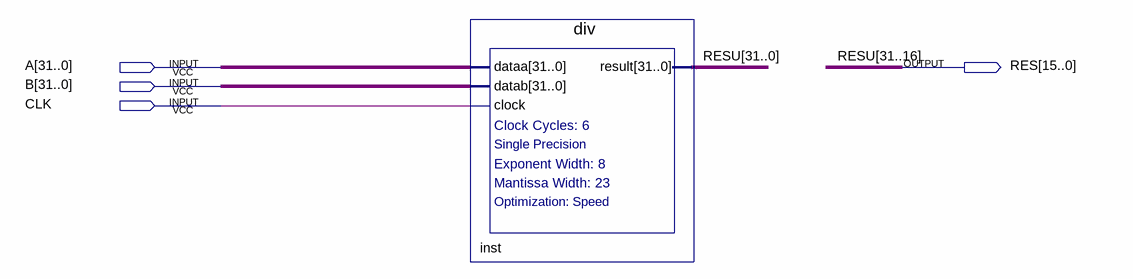
[diagram p0: schematic sheet]
// Quartus schematic 16_Bit_Div.bdf as structural Verilog: 1 symbols, 4 pins
module \16_Bit_Div  (
  input  [31:0] A,
  input  [31:0] B,
  input  CLK,
  output [15:0] RES
);

  wire [15:0] RESU;

  div inst (.dataa(A), .datab(B), .clock(CLK), .result({RES, RESU}));

  // Other names for the same wires on the sheet: RESU[31:16] = RES
endmodule
